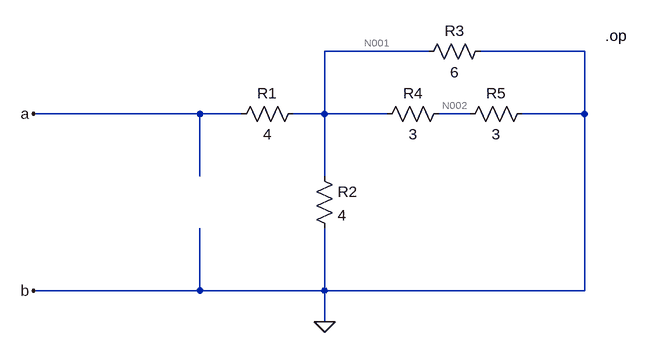
[diagram p0: schematic annulé.asc]
annulé.asc, the LTspice schematic file:
Version 4
SHEET 1 880 680
WIRE 336 -48 176 -48
WIRE 576 -48 416 -48
WIRE -16 48 -272 48
WIRE 48 48 -16 48
WIRE 176 48 176 -48
WIRE 176 48 128 48
WIRE 272 48 176 48
WIRE 400 48 352 48
WIRE 576 48 576 -48
WIRE 576 48 480 48
WIRE -16 144 -16 48
WIRE 176 144 176 48
WIRE -16 320 -16 224
WIRE -16 320 -272 320
WIRE 176 320 176 224
WIRE 176 320 -16 320
WIRE 576 320 576 48
WIRE 576 320 176 320
WIRE 176 368 176 320
FLAG -272 48 a
FLAG -272 320 b
FLAG 176 368 0
SYMBOL res 368 32 R90
WINDOW 0 0 56 VBottom 2
WINDOW 3 32 56 VTop 2
SYMATTR InstName R4
SYMATTR Value 3
SYMBOL res 496 32 R90
WINDOW 0 0 56 VBottom 2
WINDOW 3 32 56 VTop 2
SYMATTR InstName R5
SYMATTR Value 3
SYMBOL res 144 32 R90
WINDOW 0 0 56 VBottom 2
WINDOW 3 32 56 VTop 2
SYMATTR InstName R1
SYMATTR Value 4
SYMBOL res 432 -64 R90
WINDOW 0 0 56 VBottom 2
WINDOW 3 32 56 VTop 2
SYMATTR InstName R3
SYMATTR Value 6
SYMBOL res 160 128 R0
SYMATTR InstName R2
SYMATTR Value 4
TEXT 608 -72 Left 2 !.op

The netlist it stands for:
* annulé.asc
R4 N002 N001 3
R5 0 N002 3
R1 N001 a 4
R3 0 N001 6
R2 N001 0 4
.op
.backanno
.end

* Results of the author's LTspice run, read from the files saved beside the schematic
* Operating Point:
*   V(n002) = 0 V
*   V(n001) = 0 V
*   V(a) = 0 V
*   I(R2) = 0 A
*   I(R3) = 0 A
*   I(R1) = 0 A
*   I(R5) = 0 A
*   I(R4) = 0 A